# EAGLE schematic arduino_adapter+2a (EAGLE 7.3.0)
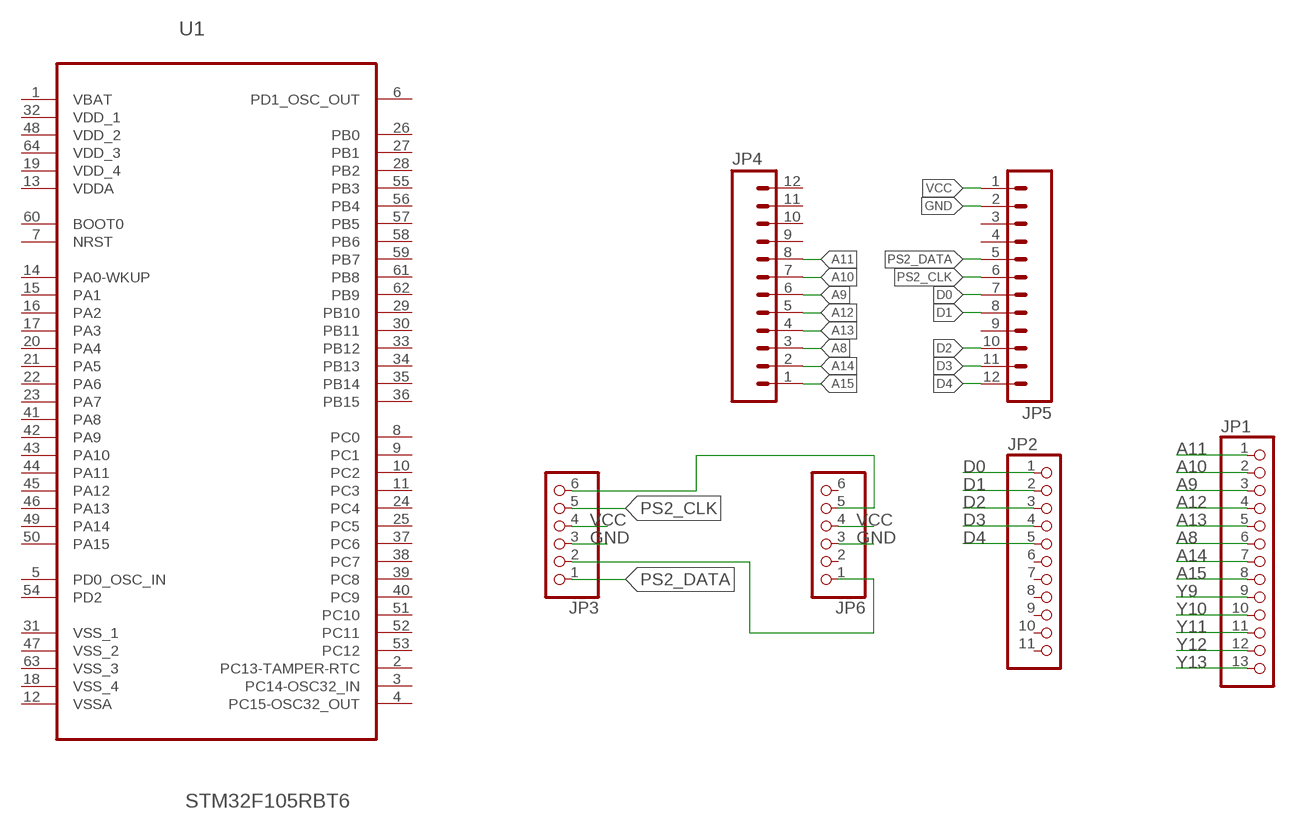
[diagram p0: schematic, sheet 1]

## Parts
JP1  PINHD-1X13  [1X13]
JP2  PINHD-1X11  [1X11]
JP3  PINHD-1X6  [1X06]
JP4  M12PTH  [1X12]
JP5  M12PTH  [1X12]
JP6  PINHD-1X6  [1X06]
U1  STM32F105RBT6  [QFP50P1200X1200X160-64N]

## Nets
A8: JP1.6 JP4.3
A9: JP1.3 JP4.6
A10: JP1.2 JP4.7
A11: JP1.1 JP4.8
A12: JP1.4 JP4.5
A13: JP1.5 JP4.4
A14: JP1.7 JP4.2
A15: JP1.8 JP4.1
D0: JP2.1 JP5.7
D1: JP2.2 JP5.8
D2: JP2.3 JP5.10
D3: JP2.4 JP5.11
D4: JP2.5 JP5.12
GND: JP3.3 JP5.2 JP6.3
N$1: JP3.6 JP6.5
N$2: JP3.2 JP6.1
PS2_CLK: JP3.5 JP5.6
PS2_DATA: JP3.1 JP5.5
VCC: JP3.4 JP5.1 JP6.4
Y9: JP1.9
Y10: JP1.10
Y11: JP1.11
Y12: JP1.12
Y13: JP1.13
Unconnected: JP2.6 JP2.7 JP2.8 JP2.9 JP2.10 JP2.11 JP4.9 JP4.10 JP4.11 JP4.12 JP5.3 JP5.4 JP5.9 JP6.2 JP6.6 U1.2(PC13-TAMPER-RTC) U1.3(PC14-OSC32_IN) U1.4(PC15-OSC32_OUT) U1.5(PD0_OSC_IN) U1.6(PD1_OSC_OUT) U1.7(NRST) U1.8(PC0) U1.9(PC1) U1.10(PC2) U1.11(PC3) U1.14(PA0-WKUP) U1.15(PA1) U1.16(PA2) U1.17(PA3) U1.20(PA4) U1.21(PA5) U1.22(PA6) U1.23(PA7) U1.24(PC4) U1.25(PC5) U1.26(PB0) U1.27(PB1) U1.28(PB2) U1.29(PB10) U1.30(PB11) U1.33(PB12) U1.34(PB13) U1.35(PB14) U1.36(PB15) U1.37(PC6) U1.38(PC7) U1.39(PC8) U1.40(PC9) U1.41(PA8) U1.42(PA9) U1.43(PA10) U1.44(PA11) U1.45(PA12) U1.46(PA13) U1.49(PA14) U1.50(PA15) U1.51(PC10) U1.52(PC11) U1.53(PC12) U1.54(PD2) U1.55(PB3) U1.56(PB4) U1.57(PB5) U1.58(PB6) U1.59(PB7) U1.60(BOOT0) U1.61(PB8) U1.62(PB9)

## Power pins joined to a net without a drawn wire
VBAT: U1.1(VBAT)
VDD_1: U1.32(VDD_1)
VDD_2: U1.48(VDD_2)
VDD_3: U1.64(VDD_3)
VDD_4: U1.19(VDD_4)
VDDA: U1.13(VDDA)
VSS_1: U1.31(VSS_1)
VSS_2: U1.47(VSS_2)
VSS_3: U1.63(VSS_3)
VSS_4: U1.18(VSS_4)
VSSA: U1.12(VSSA)

## Library data of the parts
JP1 = pinhead:PINHD-1X13: PIN HEADER
JP2 = pinhead:PINHD-1X11: PIN HEADER
JP3 JP6 = pinhead:PINHD-1X6: PIN HEADER
JP4 JP5 = SparkFun-Connectors:M12: Header 12 Standard 12-pin 0.1" header. Use with straight break away headers (SKU : PRT-00116), right angle break away headers (PRT-00553), swiss pins (PRT-00743), machine pins (PRT-00117), and female headers (PRT-00115).
U1 = iwasz-logo:STM32F105RBT6: ARM-based 32-bit MCU; MPN: STM32F105RBT6; OC_FARNELL: 1737133; OC_NEWARK: 25R9437; PACKAGE: LQFP-64; SUPPLIER: STMicroelectronics

## Net classes
1 vcc: width 0.254 mm